# EAGLE design CPB_UP_out (EAGLE 9.6.2)
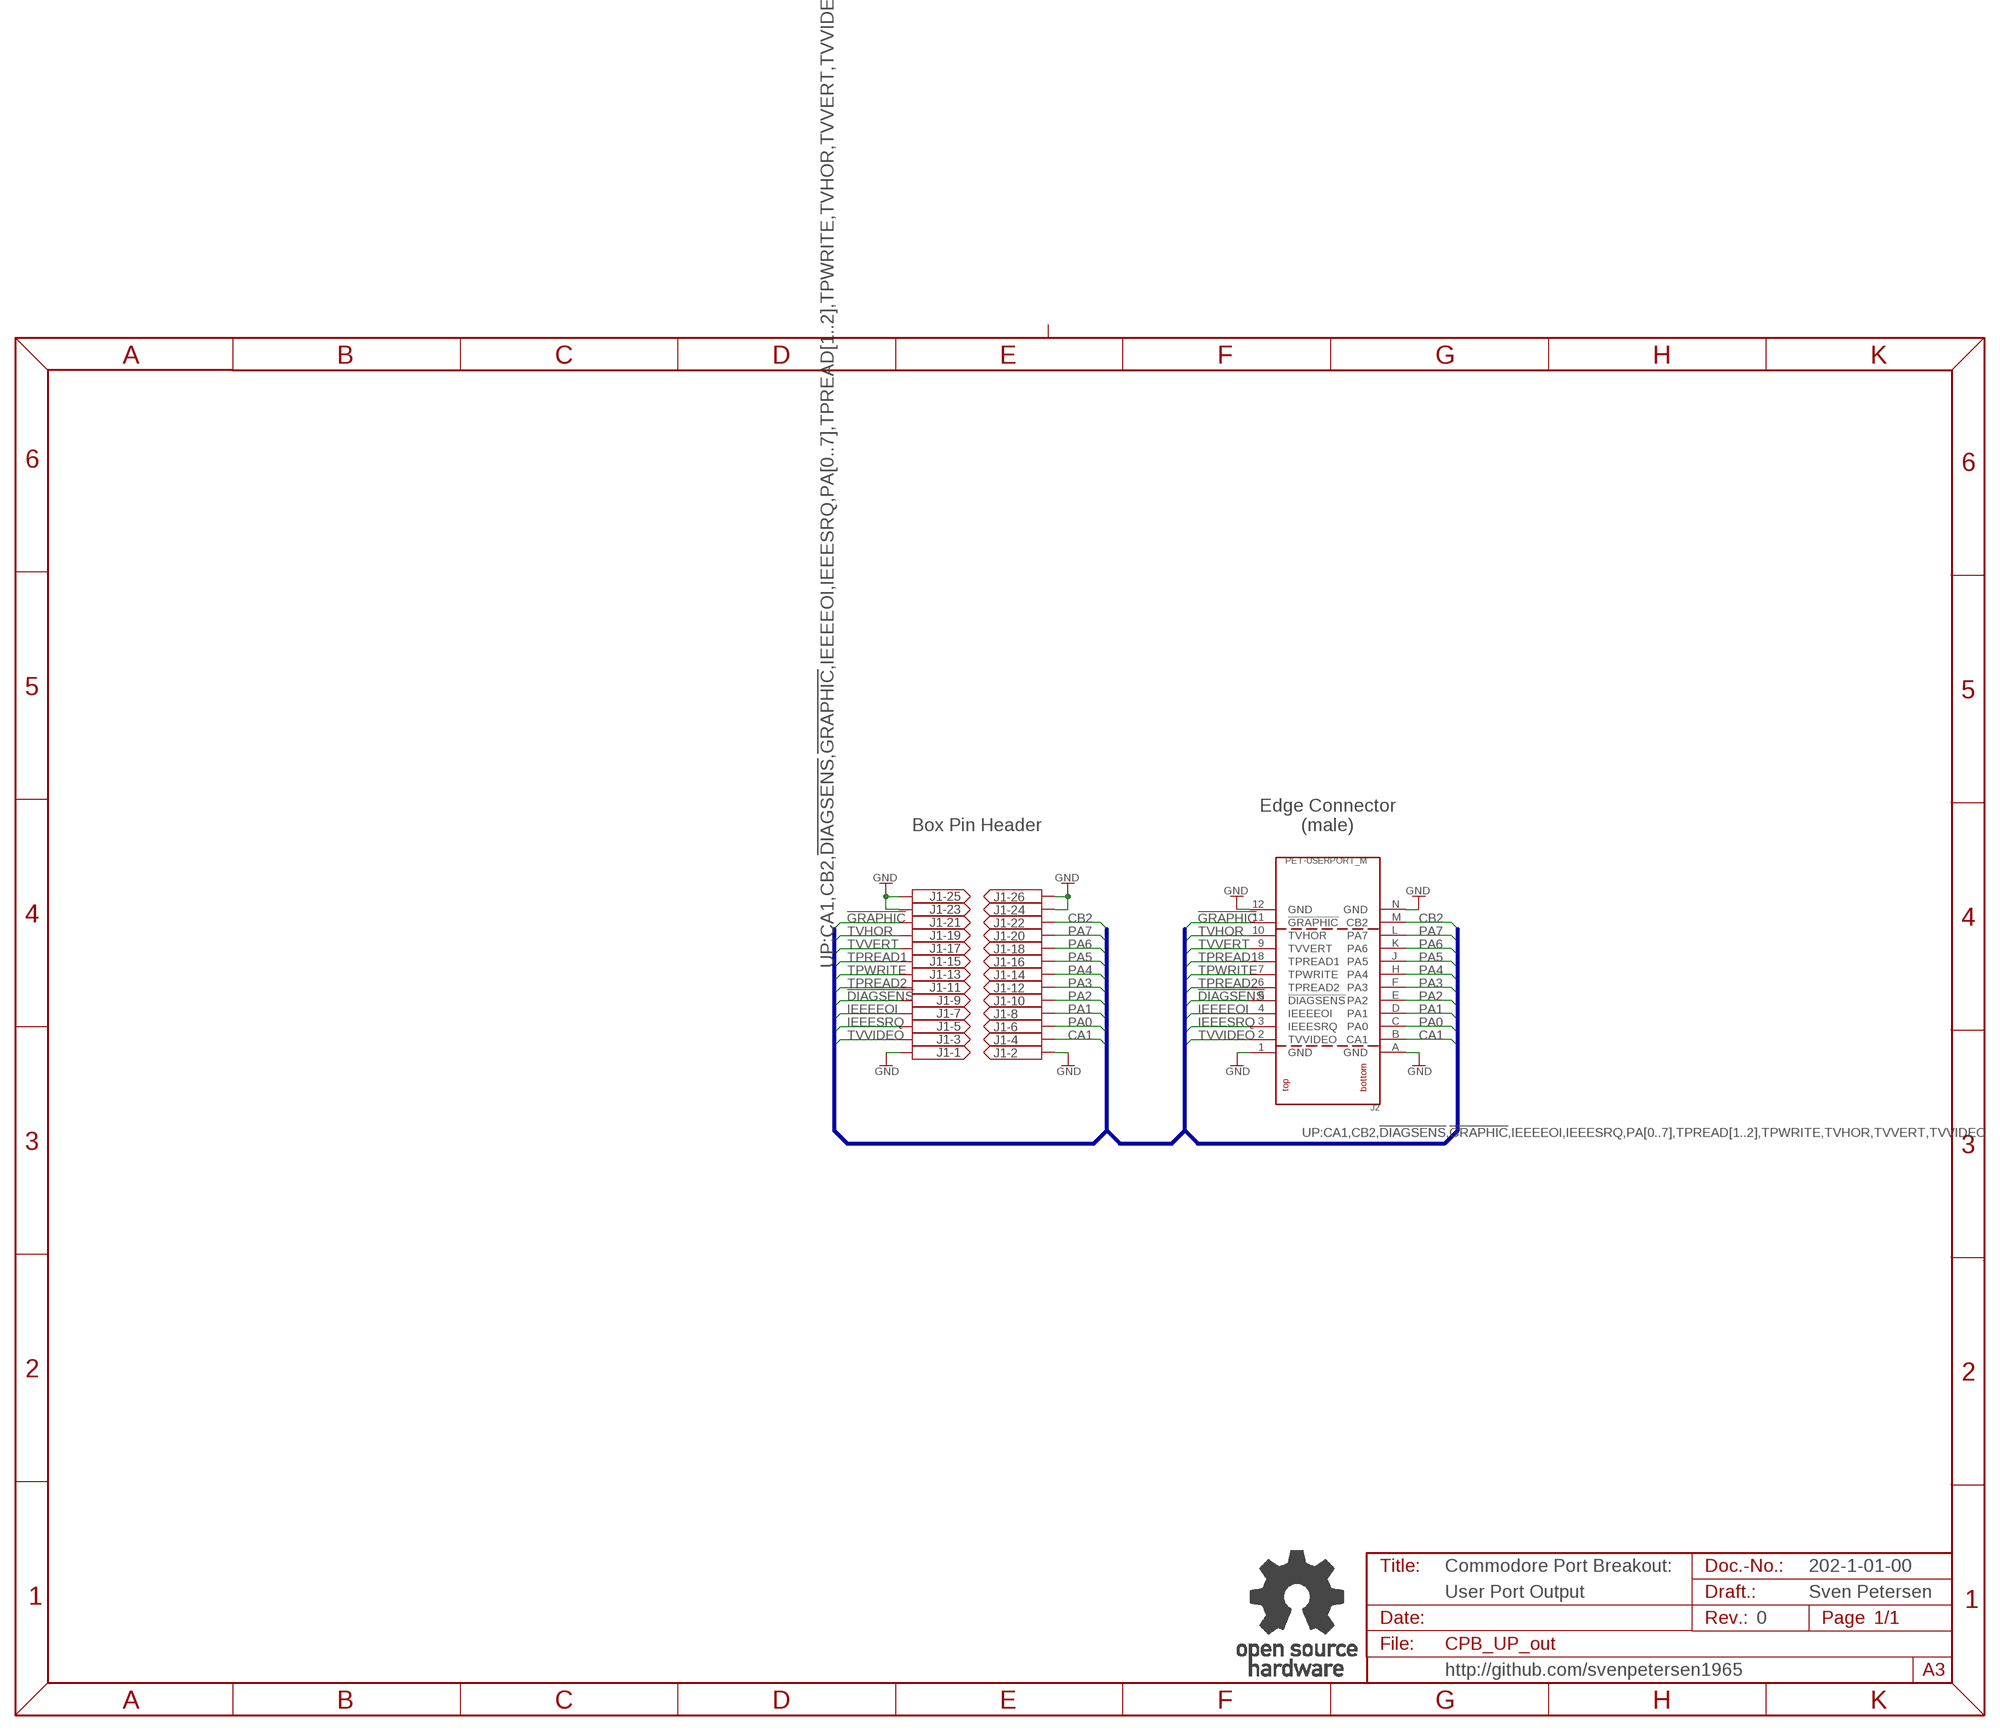
[diagram p0: schematic, sheet 1]

## Parts
J1  2X13WANNE  [2X13WV]
J2  PET-USERPORT_M  [USERPORT_M]
U$9  OPEN_SOURCE_HW  [OPENHW]

## Nets
!DIAGSENS: J1.9 J2.5(!DIAGSENS)
!GRAPHIC: J1.21 J2.11(!GRAPHIC)
CA1: J1.4 J2.B(CA1)
CB2: J1.22 J2.M(CB2)
GND: J1.1 J1.2 J1.23 J1.24 J1.25 J1.26 J2.1(GND) J2.12(GND) J2.A(GND) J2.N(GND)
IEEEEOI: J1.7 J2.4(IEEEEOI)
IEEESRQ: J1.5 J2.3(IEEESRQ)
PA0: J1.6 J2.C(PA0)
PA1: J1.8 J2.D(PA1)
PA2: J1.10 J2.E(PA2)
PA3: J1.12 J2.F(PA3)
PA4: J1.14 J2.H(PA4)
PA5: J1.16 J2.J(PA5)
PA6: J1.18 J2.K(PA6)
PA7: J1.20 J2.L(PA7)
TPREAD1: J1.15 J2.8(TPREAD1)
TPREAD2: J1.11 J2.6(TPREAD2)
TPWRITE: J1.13 J2.7(TPWRITE)
TVHOR: J1.19 J2.10(TVHOR)
TVVERT: J1.17 J2.9(TVVERT)
TVVIDEO: J1.3 J2.2(TVVIDEO)

## Buses
UP:CA1,CB2,!DIAGSENS,!GRAPHIC,IEEEEOI,IEEESRQ,PA[0..7],TPREAD[1..2],TPWRITE,TVHOR,TVVERT,TVVIDEO

## Notes on the sheet
- Box Pin Header
- Edge Connector
  (male)
- Commodore Port Breakout: | 202-1-01-00
- User Port Output | Sven Petersen
- 0
- http://github.com/svenpetersen1965

## Library data of the parts
J1 = PINHEAD:2X13WANNE
J2 = Commodore:PET-USERPORT
U$9 = Logo:OPEN_SOURCE_HW

## Board
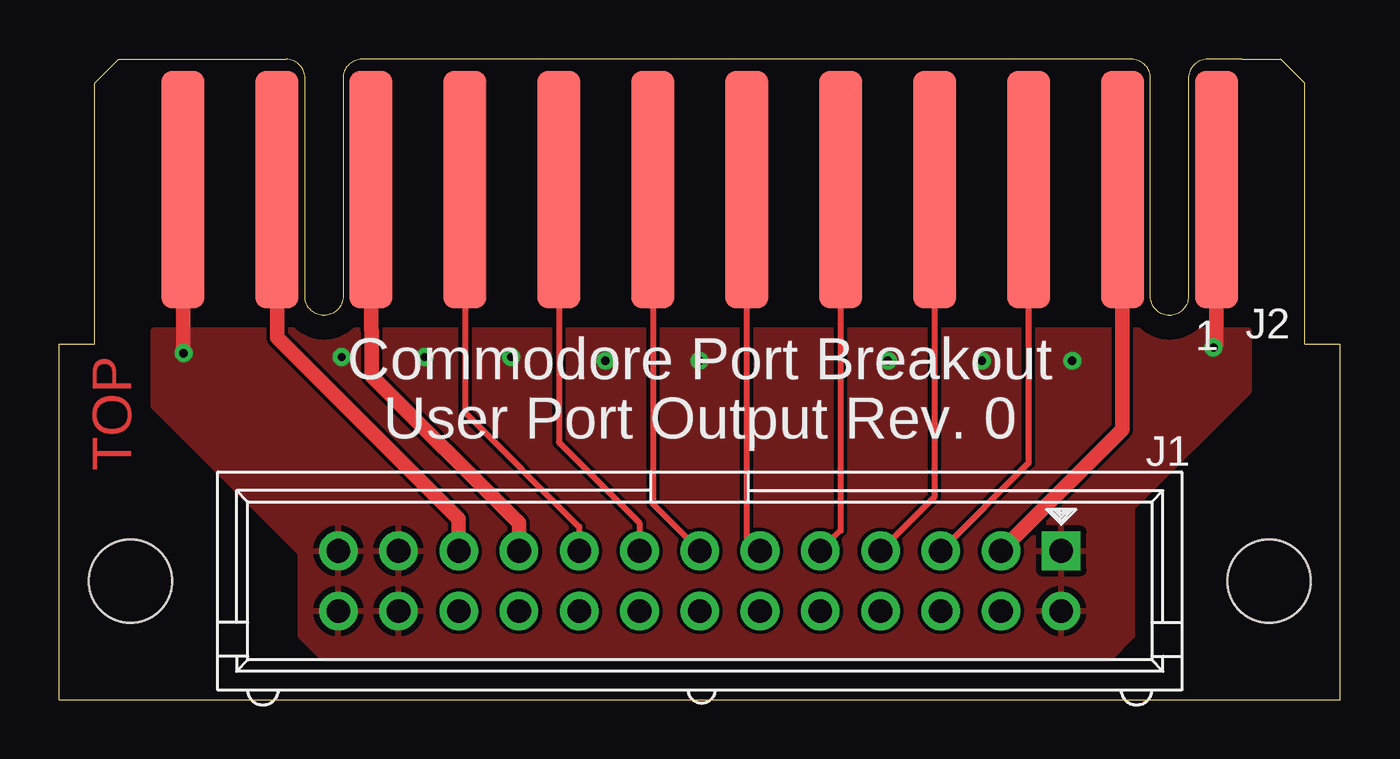
[diagram p1: board, top side]
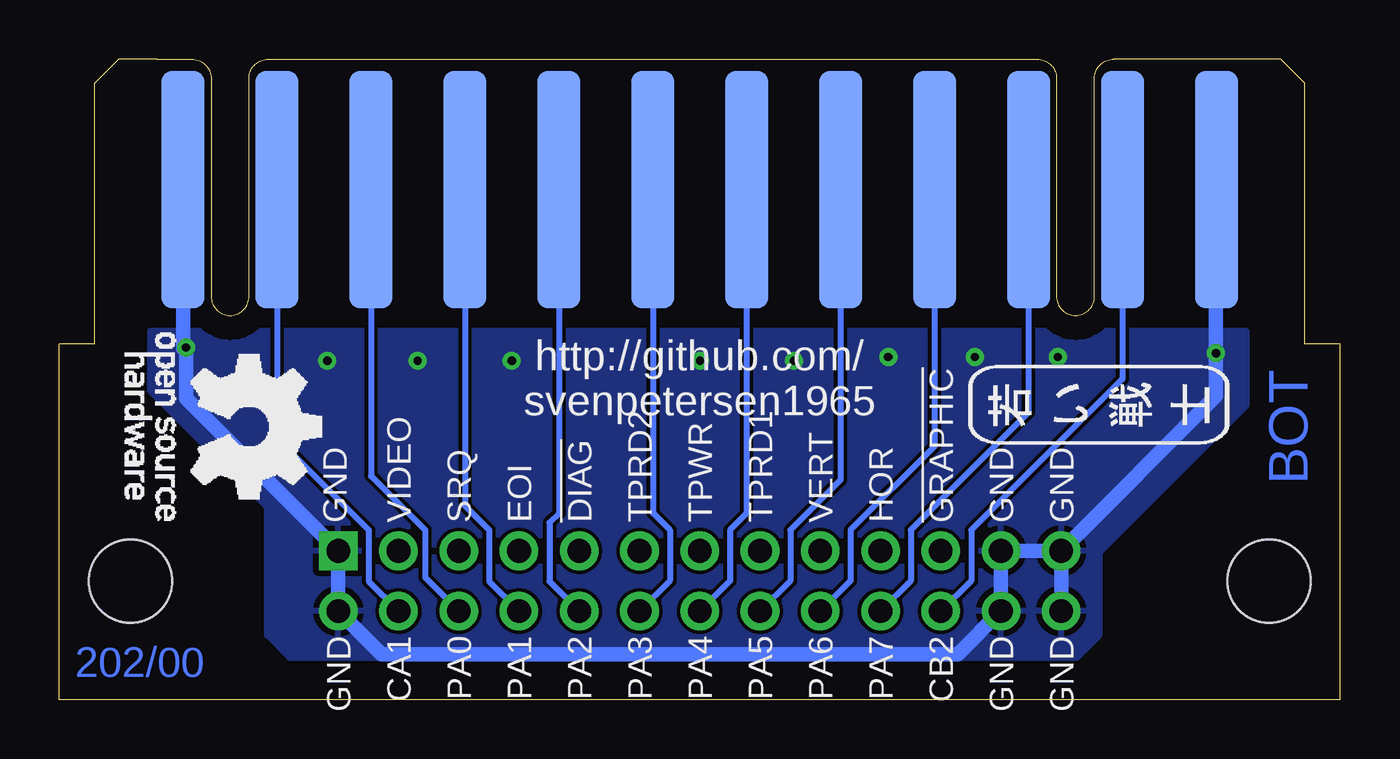
[diagram p2: board, bottom side, seen from below]

Size 54 x 27 mm. Coordinates in mm from the lower left corner, seen from the top.
Outline: 1.5,15 0.5,15 0,15 0,0 54,0 54,15 53.5,15 52.5,15
Copper layers (1*16): Top 0.035mm / dielectric 1.5mm / Bottom 0.035mm
Design rules "default *": minimum track width 6mil, minimum drill 0.35mm, track to track 6mil, track to pad 6mil, pad to pad 6mil, via to via 6mil, smd to smd 6mil, copper to edge 40mil, drill to drill 6mil, minimum pad ring 10mil, minimum via ring 8mil, stop-mask expansion 4mil, vias tented up to drill 25mil, thermal gap 10mil
Holes 3.5 mm at 3,5 51,5
bRestrict: 3 lines

### Footprints (pad centres in the part's own frame; a part is rotated, then mirrored left to right if it is on the bottom)
2X13WV = drill 1 pad 1.626 square: 1 -15.24,-1.27 | drill 1 pad 1.626: 2 -15.24,1.27; 3 -12.7,-1.27; 4 -12.7,1.27; 5 -10.16,-1.27; 6 -10.16,1.27; 7 -7.62,-1.27; 8 -7.62,1.27; 9 -5.08,-1.27; 10 -5.08,1.27; 11 -2.54,-1.27; 12 -2.54,1.27; 13 0,-1.27; 14 0,1.27; 15 2.54,-1.27; 16 2.54,1.27; 17 5.08,-1.27; 18 5.08,1.27; 19 7.62,-1.27; 20 7.62,1.27; 21 10.16,-1.27; 22 10.16,1.27; 23 12.7,-1.27; 24 12.7,1.27; 25 15.24,-1.27; 26 15.24,1.27
USERPORT_M = smd 1.8 x 10: 1 -21.78,5.5; 2 -17.82,5.5; 3 -13.86,5.5; 4 -9.9,5.5; 5 -5.94,5.5; 6 -1.98,5.5; 7 1.98,5.5; 8 5.94,5.5; 9 9.9,5.5; 10 13.86,5.5; 11 17.82,5.5; 12 21.78,5.5 | smd 1.8 x 10 bottom: A -21.78,5.5; B -17.82,5.5; C -13.86,5.5; D -9.9,5.5; E -5.94,5.5; F -1.98,5.5; H 1.98,5.5; J 5.94,5.5; K 9.9,5.5; L 13.86,5.5; M 17.82,5.5; N 21.78,5.5

### Placement (x,y rotation side)
J1  27,5 180 top
J2  27,27 180 top
U$8  [PCB-TITLE/]  0,36.82 0 top  (outside the outline)
U$9  51.22,15.45 270 bottom
U$10  [2LAYER]  3.04,9.64 90 top
U$11  [SVEN_TAG]  10.29,12.47 90 bottom

### Tracks (layer width: path | path; a pad name or v marks a point on that pad's centre or on a via)
!DIAGSENS
  Top 0.254: J2.5 32.94,7.13 J1.9
!GRAPHIC
  Top 0.254: 9.18,15.27 9.21,15.24
  Top 0.61: J2.11 9.18,15.27 | 9.21,15.24 16.84,7.61 J1.21
CA1
  Bottom 0.254: J2.B 44.82,11.01 40.96,7.14 40.96,4.99 J1.4
CB2
  Bottom 0.254: J2.M 9.18,13.52 15.56,7.14 15.56,5.01 J1.22
GND  (via drill 0.35)
  Top 0.61: J2.N 5.22,14.62 v5.24,14.61 | J2.A 48.78,14.97 v48.66,14.84
  Bottom 0.61: J2.N 5.24,21.48 v5.24,14.61 5.24,12.79 J1.25 | J1.25 J1.26 | J1.25 J1.23 J1.24 16.12,1.91 40.41,1.91 J1.2 J1.1 48.66,12.69 v48.66,14.84 48.74,14.76 48.78,14.81 J2.A
  other vias: 11.91,14.45 15.4,14.45 19.05,14.45 23.02,14.29 26.99,14.29 34.92,14.29 38.89,14.29 42.7,14.29
  pour Top: 3.97,15.56 3.97,12.38 10.16,6.19 10.16,2.7 11.11,1.75 44.29,1.75 45.24,2.7 45.24,8.1 50.16,13.02 50.16,15.56
  pour Bottom: 3.97,15.56 3.97,12.38 10.16,6.19 10.16,2.7 11.11,1.75 44.29,1.75 45.24,2.7 45.24,8.1 50.16,13.02 50.16,15.56
IEEEEOI
  Top 0.254: J2.4 36.9,8.55 J1.7
IEEESRQ
  Top 0.254: J2.3 40.86,9.97 J1.5
PA0
  Bottom 0.254: J2.C 40.86,9.43 38.58,7.14 38.58,5.15 J1.6
PA1
  Bottom 0.254: J2.D 36.9,8.17 35.88,7.14 35.88,4.99 J1.8
PA2
  Bottom 0.254: J2.E 32.94,7.86 33.34,7.46 33.34,4.99 J1.10
PA3
  Bottom 0.254: J2.F 28.98,7.87 28.26,7.14 28.26,5.01 J1.12
PA4
  Bottom 0.254: J2.H 25.02,7.84 25.72,7.14 25.72,5.01 J1.14
PA5
  Bottom 0.254: J2.J 21.06,9.26 23.18,7.14 23.18,5.01 J1.16
PA6
  Bottom 0.254: J2.K 17.1,10.68 20.64,7.14 20.64,5.01 J1.18
PA7
  Bottom 0.254: J2.L 13.14,12.1 18.1,7.14 18.1,5.01 J1.20
TPREAD1
  Top 0.254: J2.8 21.06,10.85 24.46,7.45 J1.15
TPREAD2
  Top 0.254: J2.6 28.98,6.83 J1.11
TPWRITE
  Top 0.254: J2.7 25.02,8.25 J1.13
TVHOR
  Top 0.254: 13.14,15.59 13.18,15.56
  Top 0.61: J2.10 13.14,15.59 | 13.18,15.56 13.18,13.65 19.38,7.45 J1.19
TVVERT
  Top 0.254: J2.9 17.1,12.11 21.92,7.29 J1.17
TVVIDEO
  Top 0.61: J1.3 44.82,11.39 44.82,15.51 J2.2

### Text on the board
Bottom: 202/00
tPlace: Commodore Port Breakout | User Port Output Rev. 0
bPlace: http://github.com/ / svenpetersen1965 | GND | GND | !GRAPHIC | HOR | VERT | TPRD1 | TPWR | TPRD2 | !DIAG | EOI | SRQ | VIDEO | GND | GND | GND | CB2 | PA7 | PA6 | PA5 | PA4 | PA3 | PA2 | PA1 | PA0 | CA1 | GND
Document: 202-2-01-00 | Sven Petersen / 2022 | 35µm | 2 | 0